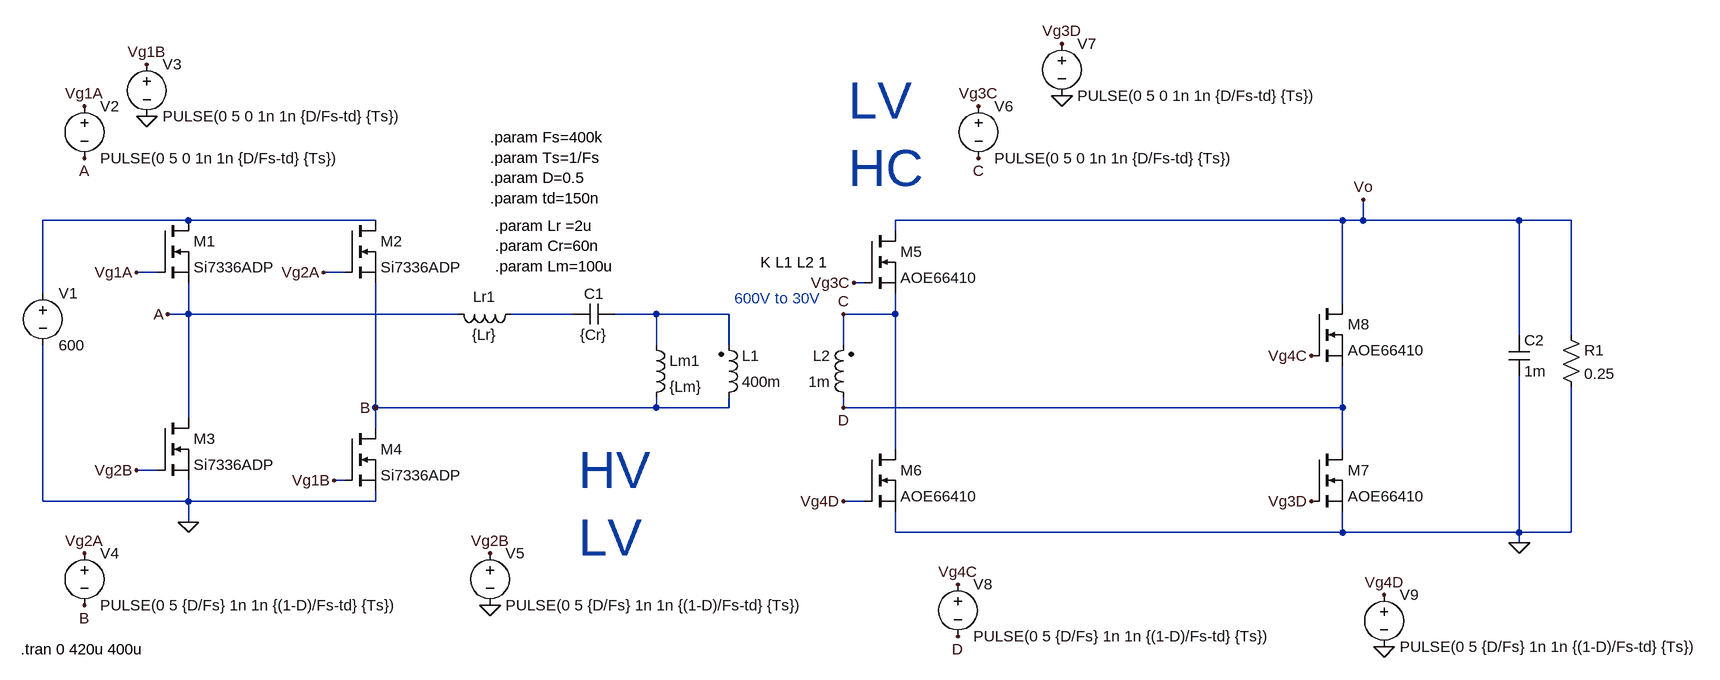
[diagram p0: schematic LLCSoftSwitchingSynchRectifier.asc]
LLCSoftSwitchingSynchRectifier.asc, the LTspice schematic file:
Version 4
SHEET 1 2208 752
WIRE -224 48 -448 48
WIRE 64 48 -224 48
WIRE 1552 48 864 48
WIRE 1584 48 1584 16
WIRE 1584 48 1552 48
WIRE 1824 48 1584 48
WIRE 1904 48 1824 48
WIRE 864 64 864 48
WIRE -272 128 -304 128
WIRE 16 128 -16 128
WIRE 816 144 800 144
WIRE -448 160 -448 48
WIRE 1552 176 1552 48
WIRE -224 192 -224 144
WIRE -224 192 -256 192
WIRE 192 192 -224 192
WIRE 368 192 272 192
WIRE 496 192 432 192
WIRE 608 192 496 192
WIRE 864 192 864 160
WIRE 864 192 784 192
WIRE 1824 224 1824 48
WIRE 1904 224 1904 48
WIRE 496 240 496 192
WIRE 608 240 608 192
WIRE 784 240 784 192
WIRE 64 336 64 144
WIRE 496 336 496 320
WIRE 496 336 64 336
WIRE 608 336 608 320
WIRE 608 336 496 336
WIRE 784 336 784 320
WIRE 1552 336 1552 272
WIRE 1552 336 784 336
WIRE -224 352 -224 192
WIRE 64 368 64 336
WIRE 864 400 864 192
WIRE 1552 400 1552 336
WIRE -272 432 -304 432
WIRE 16 448 0 448
WIRE -448 480 -448 240
WIRE -224 480 -224 448
WIRE -224 480 -448 480
WIRE 64 480 64 464
WIRE 64 480 -224 480
WIRE 816 480 784 480
WIRE -224 512 -224 480
WIRE 864 528 864 496
WIRE 1552 528 1552 496
WIRE 1552 528 864 528
WIRE 1824 528 1824 288
WIRE 1824 528 1552 528
WIRE 1904 528 1904 304
WIRE 1904 528 1824 528
WIRE 1824 544 1824 528
FLAG 1584 16 Vo
FLAG 1824 544 0
FLAG -256 192 A
FLAG 64 336 B
FLAG -304 128 Vg1A
FLAG 0 448 Vg1B
FLAG -16 128 Vg2A
FLAG -304 432 Vg2B
FLAG -224 512 0
FLAG -384 -128 Vg1A
FLAG -384 -48 A
FLAG -288 -192 Vg1B
FLAG -288 -112 0
FLAG -384 560 Vg2A
FLAG -384 640 B
FLAG 240 560 Vg2B
FLAG 240 640 0
FLAG 784 192 C
FLAG 784 336 D
FLAG 800 144 Vg3C
FLAG 1504 480 Vg3D
FLAG 1504 256 Vg4C
FLAG 784 480 Vg4D
FLAG 992 -128 Vg3C
FLAG 992 -48 C
FLAG 1120 -144 0
FLAG 1120 -224 Vg3D
FLAG 960 608 Vg4C
FLAG 960 688 D
FLAG 1616 704 0
FLAG 1616 624 Vg4D
SYMBOL voltage -448 144 R0
SYMATTR InstName V1
SYMATTR Value 600
SYMBOL nmos -272 48 R0
SYMATTR InstName M1
SYMATTR Value Si7336ADP
SYMBOL nmos 16 48 R0
SYMATTR InstName M2
SYMATTR Value Si7336ADP
SYMBOL ind 288 176 R90
WINDOW 0 5 56 VBottom 2
WINDOW 3 32 56 VTop 2
SYMATTR InstName Lr1
SYMATTR Value {Lr}
SYMBOL cap 432 176 R90
WINDOW 0 0 32 VBottom 2
WINDOW 3 32 32 VTop 2
SYMATTR InstName C1
SYMATTR Value {Cr}
SYMBOL ind 480 224 R0
SYMATTR InstName Lm1
SYMATTR Value {Lm}
SYMBOL ind2 592 336 M180
WINDOW 0 36 80 Left 2
WINDOW 3 36 40 Left 2
SYMATTR InstName L1
SYMATTR Value 400m
SYMATTR Type ind
SYMBOL ind2 800 336 R180
WINDOW 0 36 80 Left 2
WINDOW 3 36 40 Left 2
SYMATTR InstName L2
SYMATTR Value 1m
SYMATTR Type ind
SYMBOL nmos -272 352 R0
SYMATTR InstName M3
SYMATTR Value Si7336ADP
SYMBOL nmos 16 368 R0
SYMATTR InstName M4
SYMATTR Value Si7336ADP
SYMBOL cap 1808 224 R0
SYMATTR InstName C2
SYMATTR Value 1m
SYMBOL res 1888 208 R0
SYMATTR InstName R1
SYMATTR Value 0.25
SYMBOL voltage -384 -144 R0
WINDOW 123 0 0 Left 0
WINDOW 39 0 0 Left 0
SYMATTR InstName V2
SYMATTR Value PULSE(0 5 0 1n 1n {D/Fs-td} {Ts})
SYMBOL voltage -288 -208 R0
WINDOW 123 0 0 Left 0
WINDOW 39 0 0 Left 0
SYMATTR InstName V3
SYMATTR Value PULSE(0 5 0 1n 1n {D/Fs-td} {Ts})
SYMBOL voltage -384 544 R0
WINDOW 123 0 0 Left 0
WINDOW 39 0 0 Left 0
SYMATTR InstName V4
SYMATTR Value PULSE(0 5 {D/Fs} 1n 1n {(1-D)/Fs-td} {Ts})
SYMBOL voltage 240 544 R0
WINDOW 123 0 0 Left 0
WINDOW 39 0 0 Left 0
SYMATTR InstName V5
SYMATTR Value PULSE(0 5 {D/Fs} 1n 1n {(1-D)/Fs-td} {Ts})
SYMBOL nmos 816 64 R0
SYMATTR InstName M5
SYMATTR Value AOE66410
SYMBOL nmos 816 400 R0
SYMATTR InstName M6
SYMATTR Value AOE66410
SYMBOL nmos 1504 400 R0
SYMATTR InstName M7
SYMATTR Value AOE66410
SYMBOL nmos 1504 176 R0
SYMATTR InstName M8
SYMATTR Value AOE66410
SYMBOL voltage 992 -144 R0
WINDOW 123 0 0 Left 0
WINDOW 39 0 0 Left 0
SYMATTR InstName V6
SYMATTR Value PULSE(0 5 0 1n 1n {D/Fs-td} {Ts})
SYMBOL voltage 1120 -240 R0
WINDOW 123 0 0 Left 0
WINDOW 39 0 0 Left 0
SYMATTR InstName V7
SYMATTR Value PULSE(0 5 0 1n 1n {D/Fs-td} {Ts})
SYMBOL voltage 960 592 R0
WINDOW 123 0 0 Left 0
WINDOW 39 0 0 Left 0
SYMATTR InstName V8
SYMATTR Value PULSE(0 5 {D/Fs} 1n 1n {(1-D)/Fs-td} {Ts})
SYMBOL voltage 1616 608 R0
WINDOW 123 0 0 Left 0
WINDOW 39 0 0 Left 0
SYMATTR InstName V9
SYMATTR Value PULSE(0 5 {D/Fs} 1n 1n {(1-D)/Fs-td} {Ts})
TEXT 616 168 Left 2 ;600V to 30V
TEXT 248 56 Left 2 !.param Lr =2u\n.param Cr=60n\n.param Lm=100u
TEXT 240 -80 Left 2 !.param Fs=400k\n.param Ts=1/Fs\n.param D=0.5\n.param td=150n
TEXT -482 708 Left 2 !.tran 0 420u 400u
TEXT 656 112 Left 2 !K L1 L2 1
TEXT 376 432 Left 6 ;HV\nLV
TEXT 792 -136 Left 6 ;LV\nHC

The netlist it stands for:
* LLCSoftSwitchingSynchRectifier.asc
V1 N001 0 600
M1 N001 Vg1A A A Si7336ADP
M2 N001 Vg2A B B Si7336ADP
Lr1 N002 A {Lr}
C1 N003 N002 {Cr}
Lm1 N003 B {Lm}
L1 B N003 400m
L2 D C 1m
M3 A Vg2B 0 0 Si7336ADP
M4 B Vg1B 0 0 Si7336ADP
C2 Vo 0 1m
R1 Vo 0 0.25
V2 Vg1A A PULSE(0 5 0 1n 1n {D/Fs-td} {Ts})
V3 Vg1B 0 PULSE(0 5 0 1n 1n {D/Fs-td} {Ts})
V4 Vg2A B PULSE(0 5 {D/Fs} 1n 1n {(1-D)/Fs-td} {Ts})
V5 Vg2B 0 PULSE(0 5 {D/Fs} 1n 1n {(1-D)/Fs-td} {Ts})
M5 Vo Vg3C C C AOE66410
M6 C Vg4D 0 0 AOE66410
M7 D Vg3D 0 0 AOE66410
M8 Vo Vg4C D D AOE66410
V6 Vg3C C PULSE(0 5 0 1n 1n {D/Fs-td} {Ts})
V7 Vg3D 0 PULSE(0 5 0 1n 1n {D/Fs-td} {Ts})
V8 Vg4C D PULSE(0 5 {D/Fs} 1n 1n {(1-D)/Fs-td} {Ts})
V9 Vg4D 0 PULSE(0 5 {D/Fs} 1n 1n {(1-D)/Fs-td} {Ts})
.model NMOS NMOS
.model PMOS PMOS
.lib standard.mos
* 600V to 30V
.param Lr =2u
.param Cr=60n
.param Lm=100u
.param Fs=400k
.param Ts=1/Fs
.param D=0.5
.param td=150n
.tran 0 420u 400u
K L1 L2 1
* HV
* LV
* LV
* HC
.backanno
.end